# Altium schematic sheet 2V5_DRS4_SUPPLY.SchDoc: My title
size A3; Organization: University of California; Address1: 475 Portola Plaza; Address2: Los Angeles, CA 90095; Revision: R01; SheetNumber: 1; SheetTotal: 1
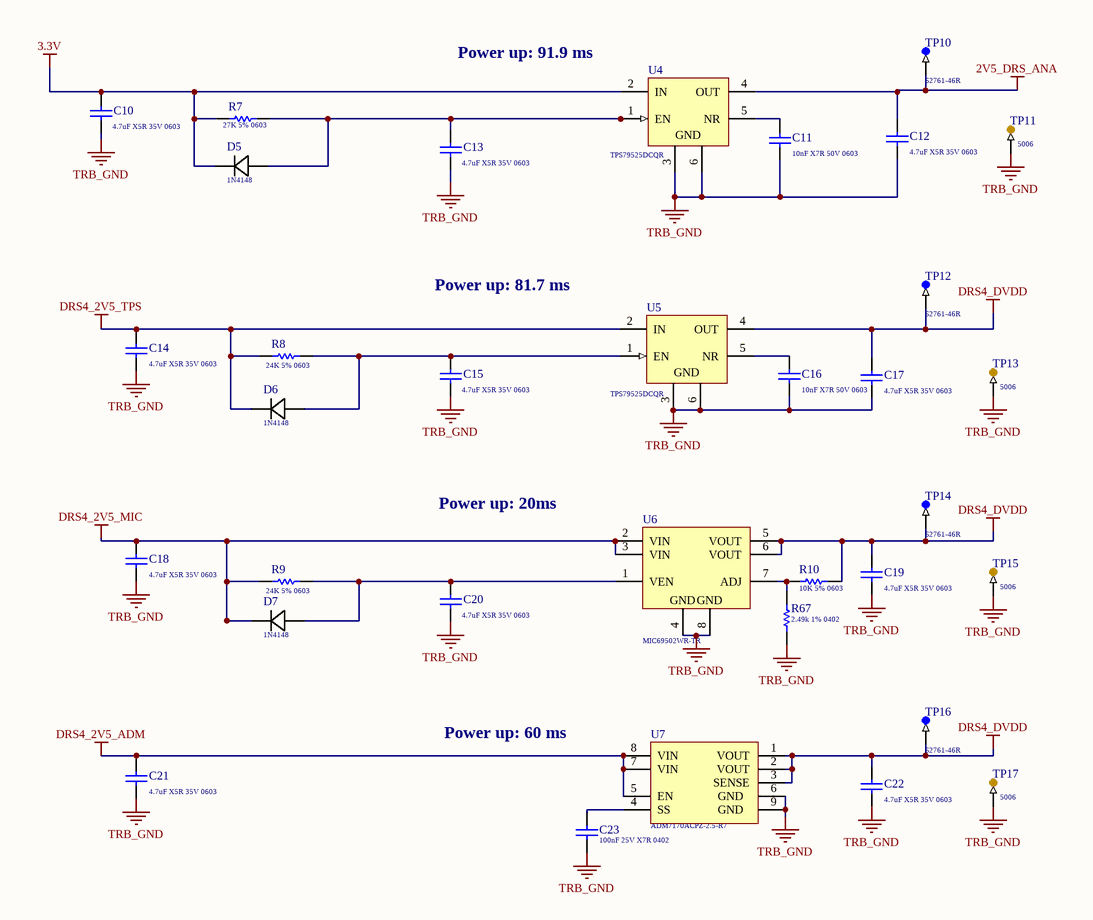
[diagram p0: 2V5_DRS4_SUPPLY.SchDoc]

## Parts
C10  Capacitance: 4.7uF X5R 35V 0603  [Cap_Murata_ZRB18AR6YA475ME05L_4.7uF]  (hidden comment: Cap_Murata_ZRB18AR6YA475ME05L_4.7uF)
C11  Capacitance: 10nF X7R 50V 0603  [Kemet_C0603_0]  (hidden comment: Cap_Kemet_C0603C103J5RACTU_eec)
C12  Capacitance: 4.7uF X5R 35V 0603  [Cap_Murata_ZRB18AR6YA475ME05L_4.7uF]  (hidden comment: Cap_Murata_ZRB18AR6YA475ME05L_4.7uF)
C13  Capacitance: 4.7uF X5R 35V 0603  [Cap_Murata_ZRB18AR6YA475ME05L_4.7uF]  (hidden comment: Cap_Murata_ZRB18AR6YA475ME05L_4.7uF)
C14  Capacitance: 4.7uF X5R 35V 0603  [Cap_Murata_ZRB18AR6YA475ME05L_4.7uF]  (hidden comment: Cap_Murata_ZRB18AR6YA475ME05L_4.7uF)
C15  Capacitance: 4.7uF X5R 35V 0603  [Cap_Murata_ZRB18AR6YA475ME05L_4.7uF]  (hidden comment: Cap_Murata_ZRB18AR6YA475ME05L_4.7uF)
C16  Capacitance: 10nF X7R 50V 0603  [Kemet_C0603_0]  (hidden comment: Cap_Kemet_C0603C103J5RACTU_eec)
C17  Capacitance: 4.7uF X5R 35V 0603  [Cap_Murata_ZRB18AR6YA475ME05L_4.7uF]  (hidden comment: Cap_Murata_ZRB18AR6YA475ME05L_4.7uF)
C18  Capacitance: 4.7uF X5R 35V 0603  [Cap_Murata_ZRB18AR6YA475ME05L_4.7uF]  (hidden comment: Cap_Murata_ZRB18AR6YA475ME05L_4.7uF)
C19  Capacitance: 4.7uF X5R 35V 0603  [Cap_Murata_ZRB18AR6YA475ME05L_4.7uF]  (hidden comment: Cap_Murata_ZRB18AR6YA475ME05L_4.7uF)
C20  Capacitance: 4.7uF X5R 35V 0603  [Cap_Murata_ZRB18AR6YA475ME05L_4.7uF]  (hidden comment: Cap_Murata_ZRB18AR6YA475ME05L_4.7uF)
C21  Capacitance: 4.7uF X5R 35V 0603  [Cap_Murata_ZRB18AR6YA475ME05L_4.7uF]  (hidden comment: Cap_Murata_ZRB18AR6YA475ME05L_4.7uF)
C22  Capacitance: 4.7uF X5R 35V 0603  [Cap_Murata_ZRB18AR6YA475ME05L_4.7uF]  (hidden comment: Cap_Murata_ZRB18AR6YA475ME05L_4.7uF)
C23  Capacitance: 100nF 25V X7R 0402  [Cap_Taiyo_Yuden_TMK105B7104KV-FR_100nF]  (hidden comment: Cap_Taiyo_Yuden_TMK105B7104KV-FR_100nF)
D5  Series: 1N4148  [Diode_ON_Semiconductor_1N4148WT_300mA]  (hidden comment: Diode_ON_Semiconductor_1N4148WT_300mA)
D6  Series: 1N4148  [Diode_ON_Semiconductor_1N4148WT_300mA]  (hidden comment: Diode_ON_Semiconductor_1N4148WT_300mA)
D7  Series: 1N4148  [Diode_ON_Semiconductor_1N4148WT_300mA]  (hidden comment: Diode_ON_Semiconductor_1N4148WT_300mA)
R7  27K 5% 0603  [RESC0603(1608)_L]
R8  24K 5% 0603  [RESC0603(1608)_L]
R9  24K 5% 0603  [RESC0603(1608)_L]
R10  10K 5% 0603  [RESC0603(1608)_L]
R67  Resistance: 2.49k 1% 0402  [Res_Yageo_RC0402FR-132K49L_2.48kOhm]  (hidden comment: Res_Yageo_RC0402FR-132K49L_2.48kOhm)
TP10  Series: S2761-46R  [TP_Harwin_S2761_46R]  (hidden comment: TP_Harwin_S2761_46R)
TP11  Series: 5006  [TP_Keystone_Electronics_5006]  (hidden comment: TP_Keystone_Electronics_5006)
TP12  Series: S2761-46R  [TP_Harwin_S2761_46R]  (hidden comment: TP_Harwin_S2761_46R)
TP13  Series: 5006  [TP_Keystone_Electronics_5006]  (hidden comment: TP_Keystone_Electronics_5006)
TP14  Series: S2761-46R  [TP_Harwin_S2761_46R]  (hidden comment: TP_Harwin_S2761_46R)
TP15  Series: 5006  [TP_Keystone_Electronics_5006]  (hidden comment: TP_Keystone_Electronics_5006)
TP16  Series: S2761-46R  [TP_Harwin_S2761_46R]  (hidden comment: TP_Harwin_S2761_46R)
TP17  Series: 5006  [TP_Keystone_Electronics_5006]  (hidden comment: TP_Keystone_Electronics_5006)
U4  TPS79525DCQR  [DCQ0006A_N]
U5  TPS79525DCQR  [DCQ0006A_N]
U6  Series: MIC69502WR-TR  [LDO_Microchip_MIC69502WR-TR_ADJ]  (hidden comment: LDO_Microchip_MIC69502WR-TR_ADJ)
U7  Series: ADM7170ACPZ-2.5-R7  [LDO_Analog_Devices_ADM7170ACPZ-2.5-R7_2.5V]  (hidden comment: LDO_Analog_Devices_ADM7170ACPZ-2.5-R7_2.5V)

## Nets
2V5_DRS_ANA: C12.2 TP10.1 U4.4(OUT)
3.3V: C10.2 D5.1 R7.1 U4.2(IN)
DRS4_2V5_ADM: C21.2 U7.5(EN) U7.7(VIN) U7.8(VIN)
DRS4_2V5_MIC: C18.2 D7.1 R9.1 U6.2(VIN) U6.3(VIN)
DRS4_2V5_TPS: C14.2 D6.1 R8.1 U5.2(IN)
DRS4_DVDD: C17.2 C19.2 C22.2 R10.2 TP12.1 TP14.1 TP16.1 U5.4(OUT) U6.5(VOUT) U6.6(VOUT) U7.1(VOUT) U7.2(VOUT) U7.3(SENSE)
TRB_GND: C10.1 C11.2 C12.1 C13.1 C14.1 C15.1 C16.2 C17.1 C18.1 C19.1 C20.1 C21.1 C22.1 C23.1 R67.1 TP11.1 TP13.1 TP15.1 TP17.1 U4.3(GND) U4.6(GND) U5.3(GND) U5.6(GND) U6.4(GND) U6.8(GND) U7.6(GND) U7.9(GND)
NetC11_1: C11.1 U4.5(NR)
NetC13_2: C13.2 D5.2 R7.2 U4.1(EN)
NetC15_2: C15.2 D6.2 R8.2 U5.1(EN)
NetC16_1: C16.1 U5.5(NR)
NetC20_2: C20.2 D7.2 R9.2 U6.1(VEN)
NetC23_2: C23.2 U7.4(SS)
NetR10_1: R10.1 R67.2 U6.7(ADJ)

## Notes on the sheet
- Power up: 91.9 ms
- Power up: 81.7 ms
- Power up: 20ms
- Power up: 60 ms
- 475 Portola Plaza
- GAPS TOF
- igarcia91@g.ucla.edu
- Los Angeles, CA
- 310-825-0344
- Size:
- Date:
- Letter
- Number:
- Time:
- Sheet
- Revision:
- of
- andrew.peck@cern.ch
- spq@ucla.edu
- File:

## Library data of the parts
C10 C12-C15 C17-C22 = Cap_Murata_ZRB18AR6YA475ME05L_4.7uF: CAP CER 4.7uF 35V X5R 0603; Supplier 1: Mouser; Supplier Part Number 1: 81-ZRB18AR6YA475ME5L
C11 C16 = Cap_Kemet_C0603C103J5RACTU_eec: CAP CER 10nF 50V X7R 0603; Manufacturer: Kemet; Mfg Package Ident: C0603; Part Number: C0603C103J5RACTU; helpURL: https://upverter.com/upn/revision/8a8d0c297e33ac74/; ComponentLink2Description: Datasheet; Temperature: -55°C to +125°C; Package: C0603; Supplier 2: Mouser; Price: 0.0184203126773; Supplier 1: Digi-Key; ComponentLink1URL: https://upverter.com/upn/revision/8a8d0c297e33ac74/; Supplier Part Number 2: 80-C0603C103J5R; Supplier Part Number 1: 399-1092-1-ND; Value: 10nF; ComponentLink1Description: Upverter; ComponentLink2URL: https://content.kemet.com/datasheets/KEM_C1002_X7R_SMD.pdf; RoHS: TRUE; Mouser Part Number: 80-C0603C103J5R; Temperature Range High: +125°C; Digikey Description: CAP CER 10000PF 50V X7R 0603; Digikey Part Number: 399-1092-1-ND; Lead Free: yes; Temperature Range Low: -55°C; Voltage: 50V
C23 = Cap_Taiyo_Yuden_TMK105B7104KV-FR_100nF: CAP CER 100nF 25V X7R 0402; Supplier 1: Mouser; Supplier Part Number 1: 963-TMK105B7104KV-FR
D5-D7 = Diode_ON_Semiconductor_1N4148WT_300mA: Diodes - General Purpose, Power, Switching SINGLE JUNC. 75V 4.0NS COMP; Supplier 1: Mouser; Supplier Part Number 1: 512-1N4148WT
R7 = CMP-1012-00108-1: 27K 0.1W 5% 0603 (1608 Metric)  SMD; Value: 27000.00 Ohm; Case-Metric: 1608; Case-EIA: 0603; Power: 0.1 W; Tolerance: 5 %; Technology: SMT
R8 R9 = CMP-1012-00107-1: 24K 0.1W 5% 0603 (1608 Metric)  SMD; Case-Metric: 1608; Case-EIA: 0603; Value: 24000.00 Ohm; Tolerance: 5 %; Technology: SMT; Power: 0.1 W
R10 = CMP-1012-00098-1: 10K 0.1W 5% 0603 (1608 Metric)  SMD; Case-EIA: 0603; Value: 10000.00 Ohm; Case-Metric: 1608; Technology: SMT; Tolerance: 5 %; Power: 0.1 W
R67 = Res_Yageo_RC0402FR-132K49L_2.48kOhm: Thick Film Resistors - SMD 2.49K ohm 1% 50V General Purpose; Supplier Part Number 1: 603-RC0402FR-132K49L; Supplier 1: Mouser
TP10 TP12 TP14 TP16 = TP_Harwin_S2761_46R: Circuit Board Hardware - PCB SMT Mini Test Terminal, Reel; Supplier 1: Newark; Supplier Part Number 1: 76Y5391
TP11 TP13 TP15 TP17 = TP_Keystone_Electronics_5006: Circuit Board Hardware - PCB TEST POINT BLK .063; Supplier 1: Mouser; Supplier Part Number 1: 534-5006
U4 U5 = TPS79525DCQR: Single Output High PSRR LDO, 500 mA, Fixed 2.5 V Output, 2.7 to 5.5 V Input, 6-pin SOT-223 (DCQ), -40 to 125 degC, Green (RoHS & no Sb/Br); Manufacturer: Texas Instruments; Accuracy(%): 2; Iq(Typ)(mA): 0.26; Vin(Min)(V): 2.7; Vout Adj(Min)(V): 2.5; SubFamily: Single Channel LDO; Vin(Max)(V): 5.5; Rating: Catalog; Iout(Max)(A): 0.5; Vdo(Typ)(mV): 110; Eco-Plan: Green (RoHS & no Sb/Br); PartNumber: TPS79525DCQR; ComponentLink1Description: Manufacturer URL; ComponentLink2Description: Datasheet; DatasheetVersion: SLVS350H; ComponentLink3URL: http://www.ti.com/litv/pdf/mpds098c; Vout Adj(Max)(V): 2.5; ComponentLink1URL: http://www.ti.com/; Fixed Output Options(V): 2.5; ComponentLink2URL: http://www.ti.com/general/docs/lit/getliterature.tsp?genericPartNumber=TPS79525&fileType=pdf; PackageReference: DCQ0006A; ComponentLink3Description: Package Specification; PackageVersion: 4202109/D; Mounting Technology: Surface Mount; PackageDescription: 6-Pin Plastic Small Outline, Body 3.5 x 6.5 mm, Pitch 1.27 mm; Supplier 1: Mouser; Supplier 2: Digi-Key; Supplier 3: Arrow; Supplier Part Number 3: TPS79525DCQR; Supplier Part Number 2: 296-41778-6-ND; Supplier Part Number 1: 595-TPS79525DCQR
U6 = LDO_Microchip_MIC69502WR-TR_ADJ: LDO Voltage Regulators 5A Low VIN LDO Regulator with 0.5Vref; Supplier Part Number 1: 998-MIC69502WRTR; Supplier 1: Mouser
U7 = LDO_Analog_Devices_ADM7170ACPZ-2.5-R7_2.5V: LDO Voltage Regulators 0.5A Hi PSRR FT LDO 2.5V; Supplier Part Number 1: 584-ADM7170ACPZ2.5R7; Supplier 1: Mouser